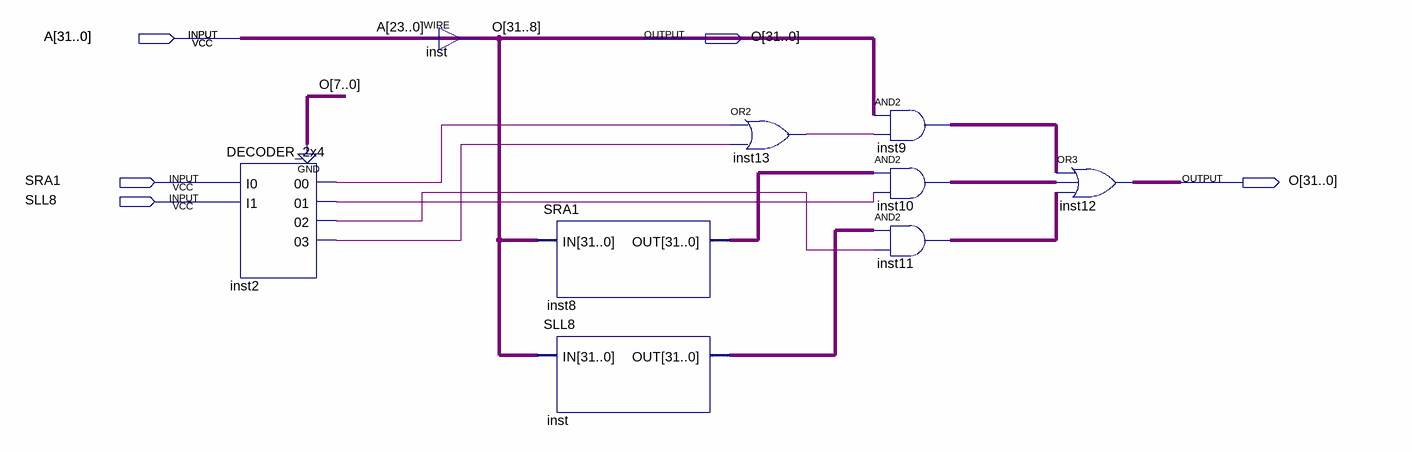
[diagram p0: schematic sheet]
// Quartus schematic SHIFTER.bdf as structural Verilog: 9 symbols, 6 pins
module SHIFTER (
  input  [31:0] A,
  input  SRA1,
  input  SLL8,
  output [31:0] O
);

  wire inst2_00, inst2_01, inst2_02, inst2_03, inst13_out;
  wire [31:0] inst8_out, inst9_out, inst10_out, inst11_out, inst_out;

  DECODER_2x4 inst2 (.I0(SRA1), .I1(SLL8), .\00 (inst2_00), .\01 (inst2_01), .\02 (inst2_02), .\03 (inst2_03));
  assign O[31:8] = A[23:0];  // WIRE inst
  SRA1 inst8 (.IN(A), .OUT(inst8_out));
  SLL8 inst_dup2 (.IN(A), .OUT(inst_out));
  or inst13 (inst13_out, inst2_00, inst2_03);
  assign inst9_out = A & {32{inst13_out}};  // AND2 inst9, 32 bits wide
  assign inst10_out = inst8_out & {32{inst2_01}};  // AND2 inst10, 32 bits wide
  assign inst11_out = inst_out & {32{inst2_02}};  // AND2 inst11, 32 bits wide
  assign O = inst9_out | inst10_out | inst11_out;  // OR3 inst12, 32 bits wide
  // also tied to GND on the sheet: {O[0], O[1], O[2], O[3], O[4], O[5], O[6], O[7]}
endmodule
